# EAGLE design board (EAGLE 9.3.1)
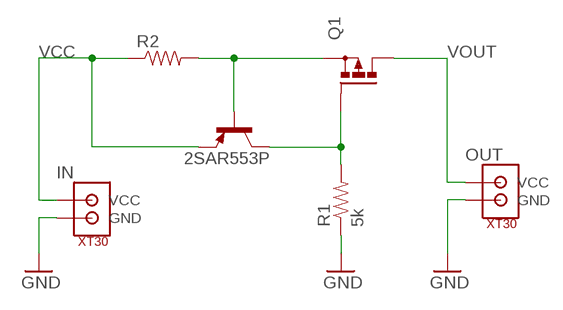
[diagram p0: schematic, sheet 1]

## Parts
2SAR553P  -PNP-SOT89-ECB  [SOT89-ECB]
IN  XT30  [XT30]
OUT  XT30  [XT30]
Q1  P-MOSFET-SO8  [SO-08]
R1  5k  RESISTOR1206  [1206]
R2  RESISTOR2512  [R2512]

## Nets
GND: IN.P$1(GND) OUT.P$1(GND) R1.1
N$1: 2SAR553P.C Q1.4(G) R1.2
N$2: 2SAR553P.B Q1.1(S) Q1.2(S) Q1.3(S) R2.2
VCC: 2SAR553P.E IN.P$2(VCC) R2.1
VOUT: OUT.P$2(VCC) Q1.5(D) Q1.6(D) Q1.7(D) Q1.8(D)

## Library data of the parts
2SAR553P = transistor:*-PNP-: PNP Transistror
IN OUT = NewKevinMade:XT30
Q1 = transistor-power:P-MOSFET-SO8: P-Channel MOSFET Example: FDS4435A; P-Channel Logic Level PowerTrench® MOSFET FDS4465; P-Channel 1.8V Specified PowerTrench® MOSFET Source: www.fairchildsemi.com
R1 R2 = SparkFun-Resistors:RESISTOR: Resistor Basic schematic elements and footprints for 0603, 1206, and PTH resistors.

## Net classes
0 default: width 1.778 mm, drill 1.016 mm, clearance 0.508 mm
1 sig: width 0.254 mm, drill 0.305 mm, clearance 0.254 mm

## Board
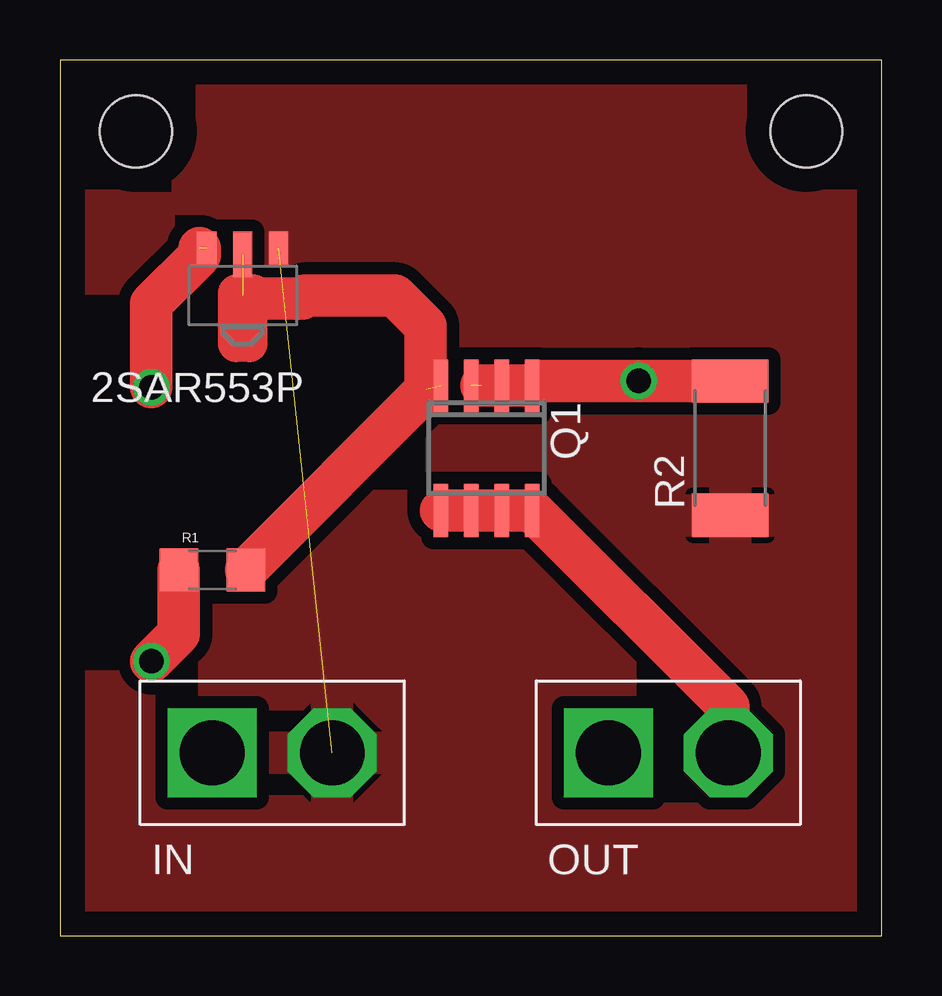
[diagram p1: board, top side]
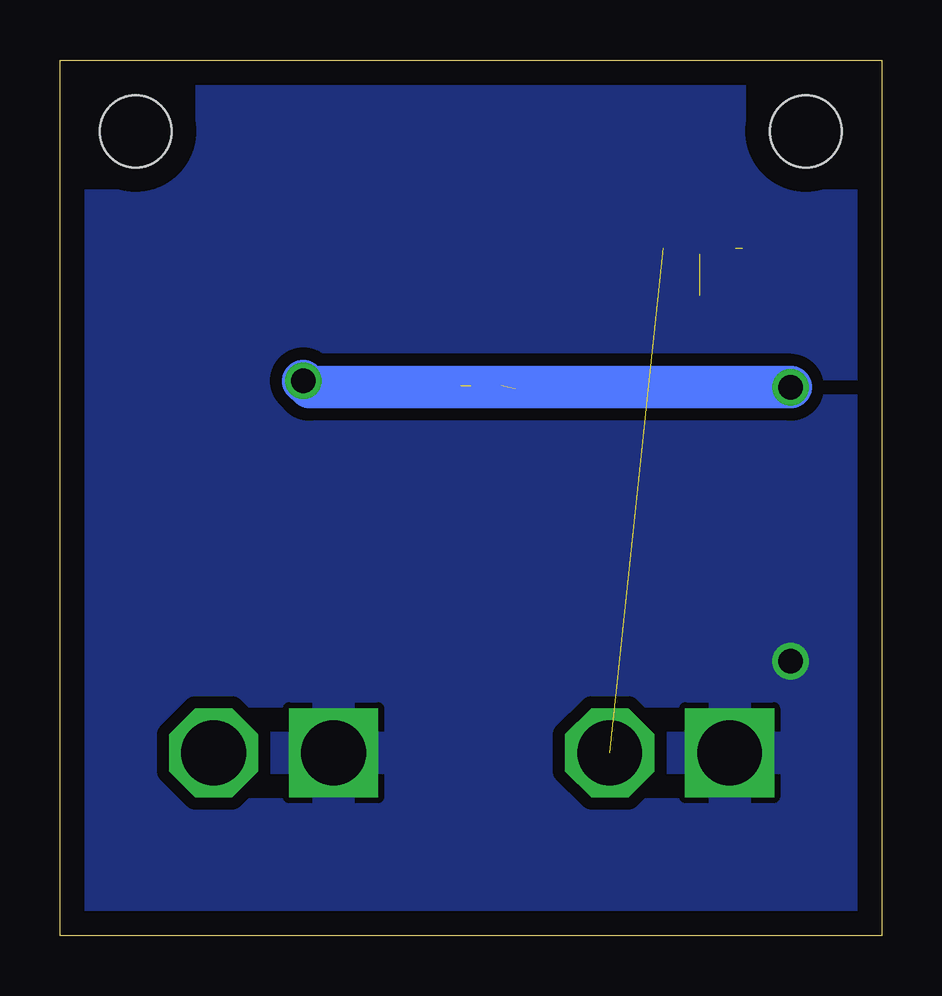
[diagram p2: board, bottom side, seen from below]

Size 34.27 x 36.5 mm. Coordinates in mm from the lower left corner, seen from the top.
Outline: 0,0 34.27,0 34.27,36.5 0,36.5 0,0
Copper layers (1*16): Top 0.035mm / dielectric 1.5mm / Bottom 0.035mm
Design rules "default": minimum track width 6mil, minimum drill 0.35mm, track to track 6mil, track to pad 6mil, pad to pad 6mil, via to via 6mil, smd to smd 6mil, copper to edge 40mil, drill to drill 6mil, minimum pad ring 10mil, minimum via ring 8mil, stop-mask expansion 4mil, vias tented up to drill 0mil, thermal gap 10mil
Holes 3 mm at 3.17,33.53 31.11,33.53

### Footprints (pad centres in the part's own frame; a part is rotated, then mirrored left to right if it is on the bottom)
SOT89-ECB = smd 0.8 x 1.4: B 1.499,-1.981; E -1.499,-1.981 | smd 0.8 x 1.9: C 0,-1.727
XT30 = drill 2.7 square: P$1 0,0 | drill 2.7 octagon: P$2 5,0
SO-08 = smd 0.6 x 2.2: 1 -1.905,-2.6; 2 -0.635,-2.6; 3 0.635,-2.6; 4 1.905,-2.6; 5 1.905,2.6; 6 0.635,2.6; 7 -0.635,2.6; 8 -1.905,2.6
1206 = smd 1.6 x 1.8: 1 -1.4,0; 2 1.4,0
R2512 = smd 1.8 x 3.2: 1 -2.8,0; 2 2.8,0

### Placement (x,y rotation side)
2SAR553P  7.62,26.67 180 top
IN  6.35,7.62 0 top
OUT  22.86,7.62 0 top
Q1  17.78,20.32 180 top
R1  6.35,15.24 0 top
R2  27.94,20.32 90 top

### Tracks (layer width: path | path; a pad name or v marks a point on that pad's centre or on a via)
GND  (via drill 1.02)
  Top 1.778: R1.1 4.95,12.57 v3.81,11.43
  pour Bottom: 0,36.83 0,0 34.29,0 34.29,36.83
N$1  (2 unrouted)
  Top 1.778: R1.2 15.29,22.78 | 15.29,22.78 15.29,22.92 | 15.29,22.78 15.24,22.82 15.24,25.4 13.97,26.67 10.21,26.67 10.1,26.55 8.14,26.55 8.02,26.67 7.62,26.67
N$2  (via drill 1.02)  (2 unrouted)
  Top 1.778: 17.57,22.92 Q1.2 Q1.1 19.89,23.12 v24.13,23.12 R2.2 | v3.81,22.86 3.81,26.34 5.82,28.35 5.82,28.65
  Bottom 1.778: v3.81,22.86 23.87,22.86 v24.13,23.12
VCC  (1 unrouted)
  pour Top: 0,36.83 0,0 34.29,0 34.29,36.83
VOUT
  Top 1.778: Q1.5 Q1.6 Q1.7 Q1.8 27.86,9.54 OUT.P$2